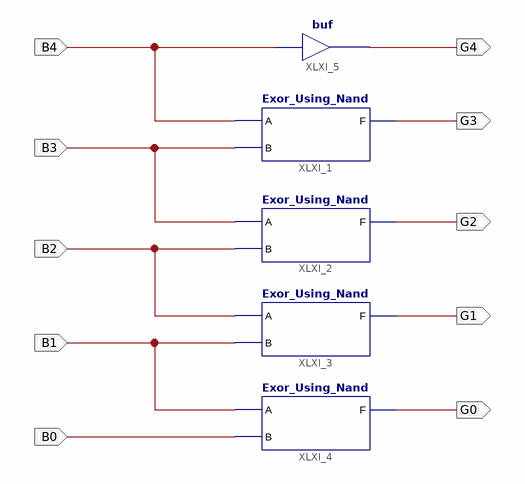
[diagram p0: schematic sheet 1]
// Xilinx ISE schematic Bin_To_Gray_5_Bits.sch (spartan3e) as structural Verilog: 5 symbols, 10 ports
module Bin_To_Gray_5_Bits (
  input  B4,
  input  B3,
  input  B2,
  input  B1,
  input  B0,
  output G4,
  output G3,
  output G2,
  output G1,
  output G0
);

  Exor_Using_Nand XLXI_1 (.A(B4), .B(B3), .F(G3));
  Exor_Using_Nand XLXI_2 (.A(B3), .B(B2), .F(G2));
  Exor_Using_Nand XLXI_3 (.A(B2), .B(B1), .F(G1));
  Exor_Using_Nand XLXI_4 (.A(B1), .B(B0), .F(G0));
  buf XLXI_5 (G4, B4);
endmodule
